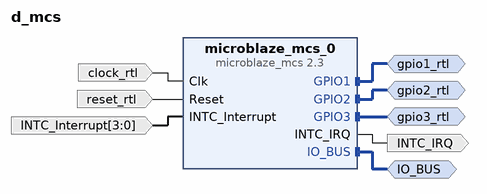
[diagram p0: block diagram of the top level]
# Vivado block design d_mcs, Vivado 2015.4_AR67478_AR66782_AR66772_AR66092_AR65813_ar68397_cr964221_2015_4
create_bd_design d_mcs

create_bd_intf_port -mode Master -vlnv xilinx.com:interface:gpio_rtl:1.0 gpio1_rtl
create_bd_intf_port -mode Master -vlnv xilinx.com:interface:mcsio_bus_rtl:1.0 IO_BUS
create_bd_intf_port -mode Master -vlnv xilinx.com:interface:gpio_rtl:1.0 gpio2_rtl
create_bd_intf_port -mode Master -vlnv xilinx.com:interface:gpio_rtl:1.0 gpio3_rtl
create_bd_port -dir I -type clk clock_rtl
set_property -dict {CONFIG.FREQ_HZ 100000000 CONFIG.PHASE 0.000} [get_bd_ports clock_rtl]
create_bd_port -dir I -type rst reset_rtl
set_property -dict {CONFIG.POLARITY ACTIVE_HIGH} [get_bd_ports reset_rtl]
create_bd_port -dir O INTC_IRQ
create_bd_port -dir I -from 3 -to 0 -type intr INTC_Interrupt
set_property -dict {CONFIG.PortWidth 4} [get_bd_ports INTC_Interrupt]

create_bd_cell -type ip -vlnv xilinx.com:ip:microblaze_mcs:2.3 microblaze_mcs_0
set_property -dict [list \
  CONFIG.MEMSIZE 65536 \
  CONFIG.USE_IO_BUS 1 \
  CONFIG.USE_GPO1 1 \
  CONFIG.USE_GPO2 1 \
  CONFIG.USE_GPO3 1 \
  CONFIG.USE_GPI1 1 \
  CONFIG.INTC_USE_EXT_INTR 1 \
  CONFIG.INTC_INTR_SIZE 4 \
  CONFIG.INTC_LEVEL_EDGE 0x0000 \
  CONFIG.INTC_POSITIVE 0xFFFF \
  CONFIG.INTC_ASYNC_INTR 0xFFFF \
] [get_bd_cells microblaze_mcs_0]

# ---- connections ----

connect_bd_intf_net [get_bd_intf_ports gpio1_rtl] [get_bd_intf_pins microblaze_mcs_0/GPIO1]
connect_bd_intf_net [get_bd_intf_ports IO_BUS] [get_bd_intf_pins microblaze_mcs_0/IO_BUS]
connect_bd_intf_net [get_bd_intf_ports gpio2_rtl] [get_bd_intf_pins microblaze_mcs_0/GPIO2]
connect_bd_intf_net [get_bd_intf_ports gpio3_rtl] [get_bd_intf_pins microblaze_mcs_0/GPIO3]
connect_bd_net [get_bd_ports clock_rtl] [get_bd_pins microblaze_mcs_0/Clk]
connect_bd_net [get_bd_ports reset_rtl] [get_bd_pins microblaze_mcs_0/Reset]
connect_bd_net [get_bd_pins microblaze_mcs_0/INTC_IRQ] [get_bd_ports INTC_IRQ]
connect_bd_net [get_bd_ports INTC_Interrupt] [get_bd_pins microblaze_mcs_0/INTC_Interrupt]

validate_bd_design
save_bd_design
